# EasyEDA Pro project ProPrj_nrf52833_LighthouseTag_2025-07-28.epro, board PCB18_1
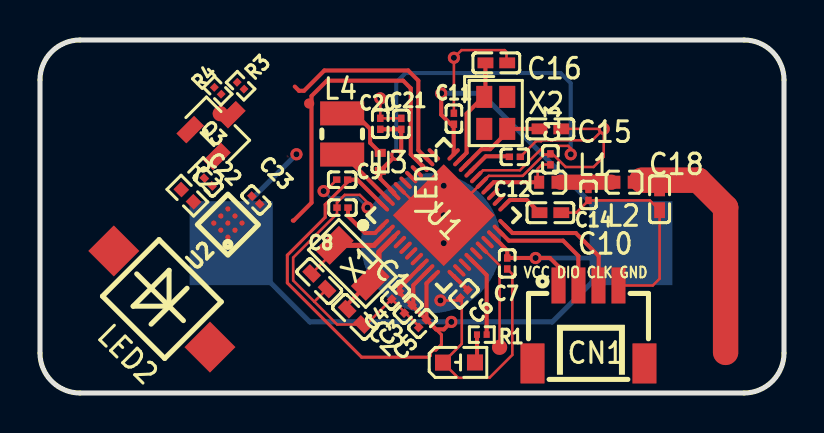
[diagram p7: board, top side]
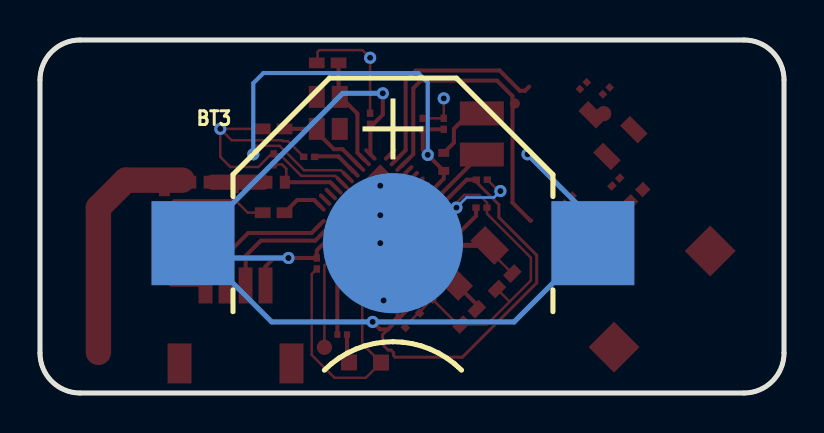
[diagram p8: board, bottom side, seen from below]

Outline 37.21 x 17.65 mm; copper layers: Top Layer, Bottom Layer. Coordinates in mm from the lower left corner of the outline.
Outline path: 0,15.65 0,2 arc(0.59,0.59) 2,0 35.21,0 arc(36.63,0.59) 37.21,2 37.21,15.65 arc(36.63,17.07) 35.21,17.65 2,17.65 arc(0.59,17.07) 0,15.65
Stack: Top Layer 0.035mm / Dielectric1 1.51mm FR4 er 4.5 / Bottom Layer 0.035mm

## Design rules (mm)
template: 用户自定义配置
spacing safeClearance (default): track to track 0.152, other pairs 0.152 to 0.3
track width trackWidth (default): min 0.127, default 0.203, max 1.27
differential pair differentialPair (default): width min 0.127, default 0.254, max 2.54; gap min 0.152, default 0.152
via viaSize (default): diameter min 0.5, default 0.61, max 10; hole min 0.3, default 0.305, max 5.999

## Placement (name value [footprint] x y rotation side)
BT3  MY-1632-03  [BAT-SMD_MY-1632-03]  19.56 7.49 180 bottom
C1  12pF  [C0402]  13.97 5.59 135 top
C2  12pF  [C0402]  15.75 3.81 135 top
C3  4.7uF  [C0201]  18.42 4.19 225 top
C4  4.7uF  [C0201]  17.78 4.89 225 top
C5  4.7uF  [C0201]  19.13 3.47 225 top
C6  4.7uF  [C0201]  21.21 4.95 225 top
C7  100nF  [C0201]  23.37 6.48 90 top
C8  100nF  [C0201]  15.13 9.27 180 top
C9  1uF  [C0201]  15.11 10.67 180 top
C10  820pF  [C0402]  25.53 9.02 0 top
C11  100nF  [C0201]  20.7 13.72 90 top
C12  100nF  [C0201]  23.75 11.81 0 top
C13  1pF  [C0201]  25.53 11.68 90 top
C14  1.2pF  [C0201]  27.43 9.91 90 top
C15  12pF  [C0402]  25.53 13.21 0 top
C16  12pF  [C0402]  22.82 16.51 0 top
C18  12pF  [C0402]  30.99 9.69 90 top
C20  47nF  [C0201]  17.02 13.46 270 top
C21  1uF  [C0201]  18.07 13.46 270 top
C22  1uF  [C0201]  8.41 10.55 135 top
C23  100nF  [C0201]  10.8 9.65 135 top
CN1  1.0-4PWB  [CONN-SMD_4P-P1.00_DEALON_1.0-4PWB]  27.43 3.43 0 top
L1  4.7nH  [IND-SMD_L1.0-W0.6]  25.4 10.54 0 top
L2  2.2nH  [IND-SMD_L1.0-W0.6]  29.21 10.54 0 top
L3  15nH  [IND-SMD_L1.0-W0.5-2]  17.02 11.56 270 top
L4  10uH  [IND-SMD_L2.5-W2.0]  15.11 12.95 90 top
LED1  NCD0603G1  [LED0603-RD_1]  20.96 1.52 0 top
LED2  VBPW34S  [SENSOR-SMD_L4.4-W3.9]  6.1 4.7 315 top
NOREF  -  [Pad_e642]  9.02 13.97 0 top
NOREF#2  -  [Pad_e648]  13.46 14.48 0 top
NOREF#3  -  [Pad_e1170]  22.99 2.29 0 top
Q3  HL3407A  [SOT-23-3_L2.9-W1.3-P1.90-LS2.4-BL-1]  8.89 13.21 315 top
R1  10kΩ  [R0201]  22.1 2.92 180 top
R2  15kΩ  [R0402]  7.37 9.87 315 top
R3  1kΩ  [R0201]  10.03 15.37 135 top
R4  1kΩ  [R0201]  8.89 15.11 315 top
U1  nRF52833-QDAA-R  [QFN-40_L5.0-W5.0-P0.40-TL-EP3.6]  20.19 8.89 45 top
U2  -  [TS4231]  9.4 8.51 135 top
X1  32.768kHz  [OSC-SMD_L3.2-W1.5]  15.62 6.48 135 top
X2  32MHz  [CRYSTAL-SMD_4P-L2.0-W1.6-BL-2]  22.79 14.01 270 top

## Footprints (pads in the part's own frame, mm; a bottom-side part is the same pattern mirrored in y, then rotated)
BAT-SMD_MY-1632-03
  rect 4.15x4.2 smd: 1(-10,0) 1(10,0)
  round 7 smd: 2(0,0)
C0201
  rect 0.368x0.324 smd: 1(-0.275,0) 2(0.275,0)
C0402
  rect 0.79x0.54 smd: 1(-0.545,0) 2(0.545,0)
CONN-SMD_4P-P1.00_DEALON_1.0-4PWB
  rect 0.7x1.8 smd: 1(-1.5,1.95) 2(-0.5,1.95) 3(0.5,1.95) 4(1.5,1.95)
  rect 1.2x2 smd: 5(2.8,-1.95) 6(-2.8,-1.95)
CRYSTAL-SMD_4P-L2.0-W1.6-BL-2
  rect 1.1x0.8 smd: 1(-0.8,-0.575) 2(0.8,-0.575) 3(0.8,0.575) 4(-0.8,0.575)
IND-SMD_L1.0-W0.5-2
  rect 0.4x0.55 smd: 1(-0.45,0) 2(0.45,0)
IND-SMD_L1.0-W0.6
  rect 0.5x0.648 smd: 1(-0.434,0) 2(0.434,0)
IND-SMD_L2.5-W2.0
  rect 1.2x2.2 smd: 1(1.028,0) 2(-1.028,0)
LED0603-RD_1
  rect 0.8x0.8 smd: 1(-0.799,-0.004) 2(0.799,0.004)
OSC-SMD_L3.2-W1.5
  rect 1.05x1.7 smd: 1(-1.275,0) 2(1.275,0)
Pad_e642
  round 0.762 smd: 1(0,0)
Pad_e648
  round 0.508 smd: 1(0,0)
Pad_e1170
  round 0.762 smd: 1(0,0)
QFN-40_L5.0-W5.0-P0.40-TL-EP3.6
  oval 0.8x0.2 smd: 1(-2.499,1.8) 2(-2.499,1.4) 3(-2.499,1) 4(-2.499,0.6) 5(-2.499,0.2) 6(-2.499,-0.2) 7(-2.499,-0.6) 8(-2.499,-1) 9(-2.499,-1.4) 10(-2.499,-1.8) 21(2.499,-1.8) 22(2.499,-1.4) 23(2.499,-1) 24(2.499,-0.6) 25(2.499,-0.2) 26(2.499,0.2) 27(2.499,0.6) 28(2.499,1) 29(2.499,1.4) 30(2.499,1.8)
  oval 0.2x0.8 smd: 11(-1.8,-2.499) 12(-1.4,-2.499) 13(-1,-2.499) 14(-0.6,-2.499) 15(-0.2,-2.499) 16(0.2,-2.499) 17(0.6,-2.499) 18(1,-2.499) 19(1.4,-2.499) 20(1.8,-2.499) 31(1.8,2.499) 32(1.4,2.499) 33(1,2.499) 34(0.6,2.499) 35(0.2,2.499) 36(-0.2,2.499) 37(-0.6,2.499) 38(-1,2.499) 39(-1.4,2.499) 40(-1.8,2.499)
  rect 3.6x3.6 smd: 41(0,0)
R0201
  rect 0.303x0.324 smd: 1(-0.241,0) 2(0.241,0)
R0402
  rect 0.566x0.54 smd: 1(-0.433,0) 2(0.433,0)
SENSOR-SMD_L4.4-W3.9
  rect 1.8x1.8 smd: 1(-3.4,0) 2(3.4,0)
SOT-23-3_L2.9-W1.3-P1.90-LS2.4-BL-1
  rect 0.7x1.25 smd: 1(-0.95,-1) 2(0.95,-1) 3(0,1)
TS4231
  round 0.262 smd: 1(-0.508,0.508) 2(-0.008,0.508) 3(0.492,0.508) 4(-0.508,0.008) 5(-0.008,0.008) 6(0.492,0.008) 7(-0.508,-0.492) 8(-0.008,-0.492) 9(0.492,-0.492)

## Nets
GND: BT3.2 C1.1 C2.1 C3.2 C4.2 C5.2 C6.2 C7.1 C8.2 C9.2 C10.2 C11.2 C12.2 C13.2 C14.1 C15.2 C16.2 C18.1 C20.1 C21.1 C22.2 C23.2 CN1.4 LED1.1 R2.1 U1.25 U1.37 U1.41 U2.4 U2.5
VDD_NRF: BT3.1 C3.1 C4.1 C5.1 C7.2 C9.1 C11.1 CN1.1 Q3.3 R4.2 U1.8 U1.9 U1.10 U1.18 U1.30 U1.40
D/CFGDATA: NOREF.1 U1.31 U2.6
DCC: L4.2 U1.39
DEC4: C20.2 C21.2 L3.2 U1.26 U1.38
E/CFGCLK: NOREF#2.1 U1.33 U2.7
LED: R1.1 U1.14
POWER_TS4231: R3.1 U1.32
RESET: NOREF#3.1 U1.16
SWDCLK: CN1.3 U1.20
SWDIO: CN1.2 U1.19
XC1: C15.1 U1.28 X2.3
XC2: C16.1 U1.29 X2.1
XL1: C1.2 U1.2 X1.2
XL2: C2.2 U1.3 X1.1
$1N2289: C10.1 U1.21
$1N2530: C13.1 L1.1 U1.24
$1N2985: C14.2 L1.2 L2.1
$1N3242: C18.2 L2.2
$1N3495: C12.1 U1.27
$1N6091: L3.1 L4.1
$1N9430: C22.1 U2.9
$1N11204: LED2.2 U2.1
$1N11226: LED2.1 U2.2
$1N11357: R2.2 U2.3
$1N22902: LED1.2 R1.2
$1N23087: C8.1 U1.1
$1N28962: C23.1 Q3.2 U2.8
$1N29852: C6.1 U1.11
$1N31595: Q3.1 R3.2 R4.1

Pads without a net: CN1 5 6; U1 4 5 6 7 12 13 15 17 22 23 34 35 36; X2 2 4

## Via types
v1: diameter 0.61, hole 0.305, Top Layer to Bottom Layer, 15 vias

## Routing (per net, layer and track width the routed paths; a pad name or vN(x,y) marks a point on that pad's centre or on a via; arc(x,y) is an arc through that point)
GND: length 72.9
  Top Layer w0.127: v1(17.02,14.73) C20.1 18.07,13.74 C21.1 ; C1.1 13.72,4.57 13.72,4.57 ; v1(28.19,13.21) 28.19,11.81 27.69,11.3 26.29,11.3 25.63,11.96 C13.2 25.4,11.96 25.37,11.92 25.21,11.92 24.14,10.86 22.44,10.86 U1.25 20.48,8.89 v1(20.19,8.89) 19.34,8.89 U1.37 ; v1(28.19,13.21) C15.2 ; v1(28.19,13.21) 27.62,12.64 25.11,12.64 25.06,12.59 24.81,12.59 C12.2 ; C16.2 23.33,16.55 23.33,17.05 23.24,17.14 21.08,17.14 v1(20.7,16.76) C11.2 ; v1(16.38,9.27) 16.38,9.52 16,9.91 15.24,9.91 14.85,9.52 C8.2 14.85,8.96 12.66,6.77 12.66,5.63 13.72,4.57 ; CN1.4 30.65,5.38 30.99,5.71 C18.1 30.5,9.63 C14.1 26.82,9.02 C10.2 ; 13.72,4.57 14.86,3.42 C2.1 16.32,3.42 C4.2 18.94,3.34 C5.2 ; v1(20.03,4.63) 20.89,4.63 21.02,4.76 21.09,4.68 21.09,2.46 LED1.1 20.91,0.76 22.48,0.76 23.62,1.91 23.62,5.95 C7.1 ; v1(14.18,10.1) 14.27,10.1 C9.2
  Bottom Layer w0.127: v1(16.38,9.27) 15.88,9.78 14.5,9.78 v1(14.18,10.1)
  vias: v1(20.19,10.36) v1(20.19,7.49)
VDD_NRF: length 83.1
  Top Layer w0.152: 19.81,3.18 20.08,2.92 20.08,2.42 19.8,2.15 19.66,2.15 19.53,2.02 19.53,1.87 19.44,1.79 16.08,1.79 12.37,5.5 12.37,6.89 14.26,8.78 14.26,9.42 15.39,10.55 C9.1
  Top Layer w0.203: v1(20.07,14.99) 20.07,13.92 20.54,13.44 C11.1 20.69,13.43 U1.30 ; C5.1 19.33,5.48 19.7,5.85 ; C5.1 18.61,4.38 ; C5.1 19.81,3.18 20.2,3.18 v1(20.57,3.56) ; 18.61,4.38 18.67,4.44 18.67,5.39 U1.9 ; 18.61,4.38 17.98,5.02 C4.1 17.98,5.26 U1.8 ; 22.67,7.83 23.37,7.13 C7.2 v1(24.79,6.75) 25.51,6.75 25.93,6.33 CN1.1 ; U1.40 15.87,10.67 C9.1
  Bottom Layer w0.254: v1(24.79,6.75) 28.82,6.75 ; 28.82,6.75 BT3.1 22.06,14.99 v1(20.07,14.99) ; 28.82,6.75 25.62,3.56 v1(20.57,3.56) 13.5,3.56 BT3.1 9.56,8.67 v1(12.83,11.94)
DCC: length 3.1
  Top Layer w0.203: U1.39 15.56,11.54 15.11,11.54
DEC4: length 27
  Top Layer w0.127: 21.82,10.8 22.16,11.14 24,11.14 25.22,12.36 26.42,12.36 26.54,12.23 v1(26.54,11.94)
  Top Layer w0.203: 18.07,13.19 18.07,12.15 v1(17.82,11.91) L3.2 17.02,10.72 17.72,10.02 U1.38 ; 18.07,13.19 C20.2 ; 18.07,13.19 C21.2
  Bottom Layer w0.203: v1(17.82,11.91) 17.82,15.53 18.29,16 26.04,16 26.54,15.49 v1(26.54,11.94)
E/CFGCLK: length 16.2
  Top Layer w0.203: U1.33 19.12,11.36 18.54,11.94 18.54,15.24 18.16,15.62 14.35,15.62 13.58,14.85 13.58,9.52 12.69,8.62 12.65,8.62
LED: length 4.1
  Top Layer w0.203: R1.1 22.34,5.89 U1.14
POWER_TS4231: length 11.1
  Top Layer w0.203: U1.32 18.92,12.14 18.92,15.62 18.42,16.13 14.22,16.13 13.21,15.11 12.95,15.11 12.74,15.32
RESET: length 5.4
  Top Layer w0.127: 22.1,7.26 22.99,6.38 22.99,2.41 22.86,2.29
SWDCLK: length 6.8
  Top Layer w0.203: 23.23,8.4 23.63,8 26.8,8 27.94,6.86 27.94,5.39 CN1.3
SWDIO: length 6
  Top Layer w0.203: U1.19 23.44,7.62 26.16,7.62 26.92,6.86 26.92,5.39 CN1.2
XC1: length 4.6
  Top Layer w0.203: C15.1 X2.3 23.44,13.14 23.44,13.12 22.51,12.19 22.08,12.19 21.25,11.36
XC2: length 5.4
  Top Layer w0.203: C16.1 22.28,14.87 X2.1 22.17,14.81 21.34,13.97 21.34,12.01 U1.29
XL1: length 4.9
  Top Layer w0.127: X1.2 14.72,7.11 C1.2
  Top Layer w0.254: U1.2 16.71,7.38 X1.2
XL2: length 4.6
  Top Layer w0.203: C2.2 15.36,4.42 X1.1
  Top Layer w0.254: X1.1 16.95,6.01 16.95,7.05 17.72,7.83
$1N2289: length 2.1
  Top Layer w0.203: C10.1 24.35,9.65 23.5,9.65 23.23,9.38
$1N2530: length 3.9
  Top Layer w0.127: 24.89,10.79 24.89,11.21 25.11,11.43 25.51,11.43 C13.1
  Top Layer w0.203: U1.24 22.69,10.54 L1.1
$1N2985: length 2.5
  Top Layer w0.762: 26.04,10.54 28.58,10.54
$1N3242: length 12
  Top Layer w1.27: 30.1,10.64 32.92,10.64 34.29,9.27 34.29,2.03
$1N3495: length 2.2
  Top Layer w0.203: U1.27 21.55,11.09 arc(21.56,11.1) 21.57,11.11 22.29,11.84 23.45,11.84
$1N6091: length 3
  Top Layer w0.203: 15.11,13.6 16.12,13.6 16.51,13.21 16.51,12.52 L3.1
$1N22902: length 1.2
  Top Layer w0.203: 21.84,1.69 21.86,1.7 R1.2
$1N23087: length 2.7
  Top Layer w0.203: C8.1 15.4,8.85 16.26,8 16.76,8 U1.1
$1N29852: length 1
  Top Layer w0.203: 20.69,5.85 20.7,5.85 C6.1

Small or netless copper shapes (teardrops, artwork), in the pictures only: 1 on Top Layer

## Text on the board
Top Silkscreen Layer: VCC DIO CLK GND
